# Altium schematic sheet SH4 - Level Shifter.SchDoc
size A4
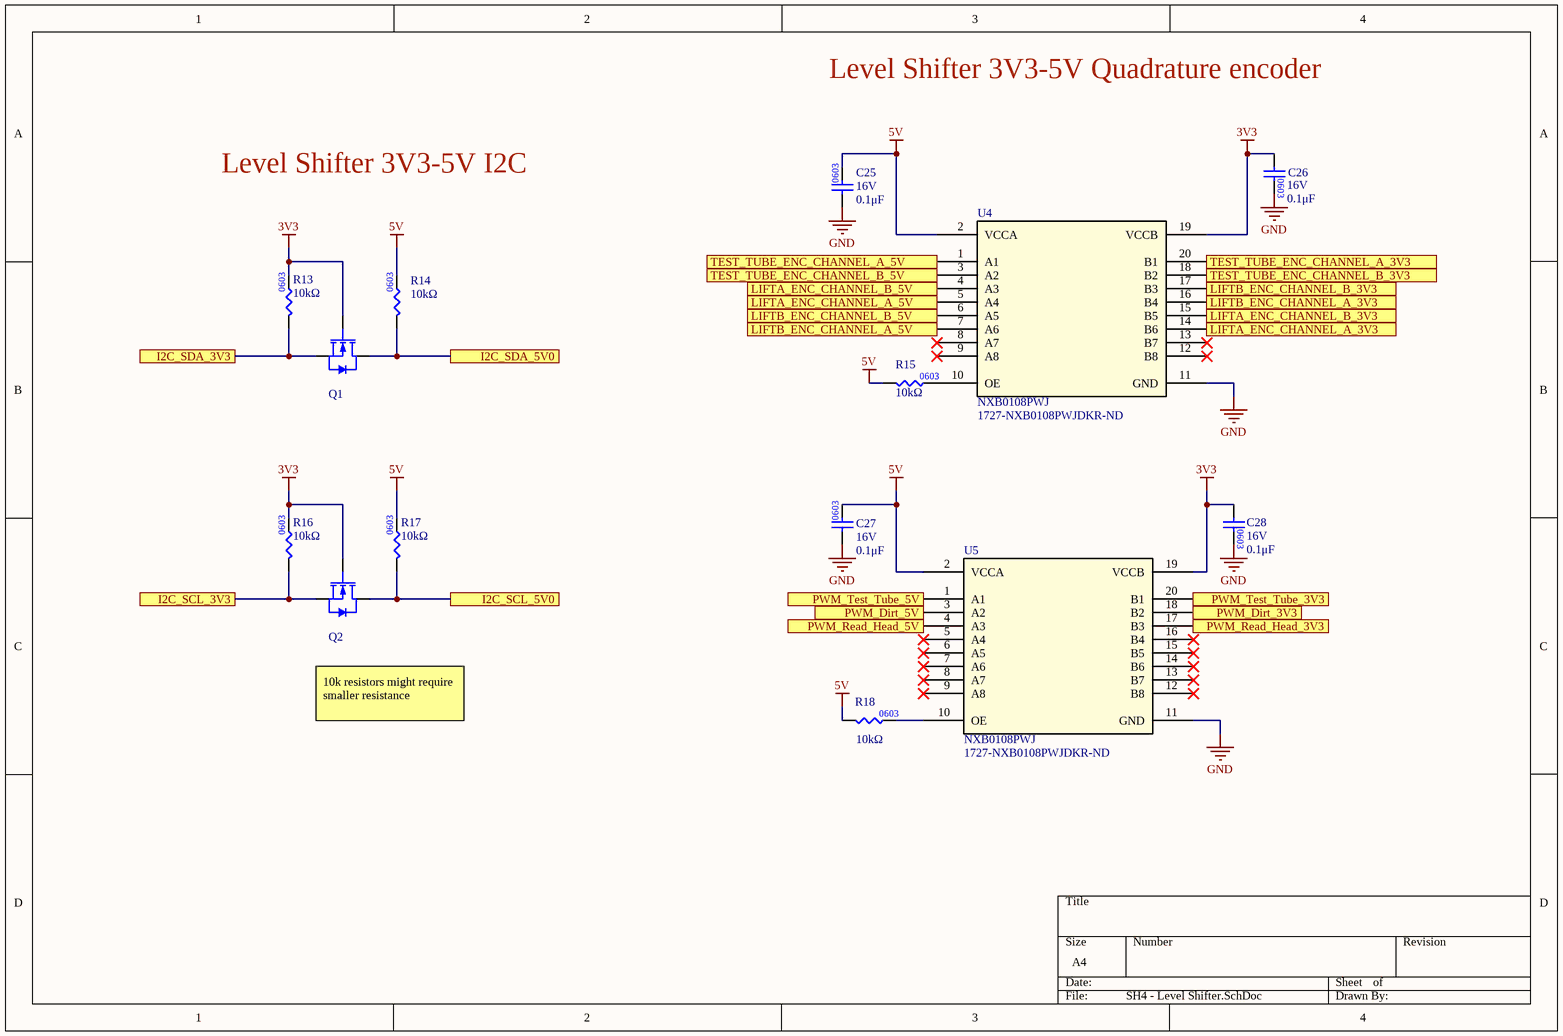
[diagram p0: SH4 - Level Shifter.SchDoc]

## Parts
C25  value 0.1μF  Voltage Rating: 16V  [CAP0603]  (hidden comment: CAP_0.1uF_16V_0603)
C26  value 0.1μF  Voltage Rating: 16V  [CAP0603]  (hidden comment: CAP_0.1uF_16V_0603)
C27  value 0.1μF  Voltage Rating: 16V  [CAP0603]  (hidden comment: CAP_0.1uF_16V_0603)
C28  value 0.1μF  Voltage Rating: 16V  [CAP0603]  (hidden comment: CAP_0.1uF_16V_0603)
Q1  NMOS_60V_280mA  [SOT-323]  (value not drawn)
Q2  NMOS_60V_280mA  [SOT-323]  (value not drawn)
R13  value 10kΩ  [RES0603]  (hidden comment: RES_10kΩ_0603_5%)
R14  value 10kΩ  [RES0603]  (hidden comment: RES_10kΩ_0603_5%)
R15  value 10kΩ  [RES0603]  (hidden comment: RES_10kΩ_0603_5%)
R16  value 10kΩ  [RES0603]  (hidden comment: RES_10kΩ_0603_5%)
R17  value 10kΩ  [RES0603]  (hidden comment: RES_10kΩ_0603_5%)
R18  value 10kΩ  [RES0603]  (hidden comment: RES_10kΩ_0603_5%)
U4  Manufacturer Part Number 1: NXB0108PWJ  Supplier Part Number 1: 1727-NXB0108PWJDKR-ND  [LEVEL_SHIFTER_8_CHANNEL]  (hidden comment: IC_LVL_SHIFTER_8_CH)
U5  Manufacturer Part Number 1: NXB0108PWJ  Supplier Part Number 1: 1727-NXB0108PWJDKR-ND  [LEVEL_SHIFTER_8_CHANNEL]  (hidden comment: IC_LVL_SHIFTER_8_CH)

## Ports
I2C_SCL_3V3, I2C_SCL_5V0, I2C_SDA_3V3, I2C_SDA_5V0, LIFTA_ENC_CHANNEL_A_3V3, LIFTA_ENC_CHANNEL_A_5V, LIFTA_ENC_CHANNEL_B_3V3, LIFTA_ENC_CHANNEL_B_5V, LIFTB_ENC_CHANNEL_A_3V3, LIFTB_ENC_CHANNEL_A_5V, LIFTB_ENC_CHANNEL_B_3V3, LIFTB_ENC_CHANNEL_B_5V, PWM_Dirt_3V3, PWM_Dirt_5V, PWM_Read_Head_3V3, PWM_Read_Head_5V, PWM_Test_Tube_3V3, PWM_Test_Tube_5V, TEST_TUBE_ENC_CHANNEL_A_3V3, TEST_TUBE_ENC_CHANNEL_A_5V, TEST_TUBE_ENC_CHANNEL_B_3V3, TEST_TUBE_ENC_CHANNEL_B_5V

## Nets
3V3: C26.1 C28.1 Q1.1(Gate) Q2.1(Gate) R13.2 R16.2 U4.19(VCCB) U5.19(VCCB)
5V: C25.2 C27.2 R14.2 R15.1 R17.2 R18.1 U4.2(VCCA) U5.2(VCCA)
GND: C25.1 C26.2 C27.1 C28.2 U4.11(GND) U5.11(GND)
I2C_SCL_3V3: Q2.2(Source) R16.1 ; port I2C_SCL_3V3
I2C_SCL_5V0: Q2.3(Drain) R17.1 ; port I2C_SCL_5V0
I2C_SDA_3V3: Q1.2(Source) R13.1 ; port I2C_SDA_3V3
I2C_SDA_5V0: Q1.3(Drain) R14.1 ; port I2C_SDA_5V0
LIFTA_ENC_CHANNEL_A_3V3: U4.14(B6) ; port LIFTA_ENC_CHANNEL_A_3V3
LIFTA_ENC_CHANNEL_A_5V: U4.5(A4) ; port LIFTA_ENC_CHANNEL_A_5V
LIFTA_ENC_CHANNEL_B_3V3: U4.15(B5) ; port LIFTA_ENC_CHANNEL_B_3V3
LIFTA_ENC_CHANNEL_B_5V: U4.4(A3) ; port LIFTA_ENC_CHANNEL_B_5V
LIFTB_ENC_CHANNEL_A_3V3: U4.16(B4) ; port LIFTB_ENC_CHANNEL_A_3V3
LIFTB_ENC_CHANNEL_A_5V: U4.7(A6) ; port LIFTB_ENC_CHANNEL_A_5V
LIFTB_ENC_CHANNEL_B_3V3: U4.17(B3) ; port LIFTB_ENC_CHANNEL_B_3V3
LIFTB_ENC_CHANNEL_B_5V: U4.6(A5) ; port LIFTB_ENC_CHANNEL_B_5V
PWM_Dirt_3V3: U5.18(B2) ; port PWM_Dirt_3V3
PWM_Dirt_5V: U5.3(A2) ; port PWM_Dirt_5V
PWM_Read_Head_3V3: U5.17(B3) ; port PWM_Read_Head_3V3
PWM_Read_Head_5V: U5.4(A3) ; port PWM_Read_Head_5V
PWM_Test_Tube_3V3: U5.20(B1) ; port PWM_Test_Tube_3V3
PWM_Test_Tube_5V: U5.1(A1) ; port PWM_Test_Tube_5V
TEST_TUBE_ENC_CHANNEL_A_3V3: U4.20(B1) ; port TEST_TUBE_ENC_CHANNEL_A_3V3
TEST_TUBE_ENC_CHANNEL_A_5V: U4.1(A1) ; port TEST_TUBE_ENC_CHANNEL_A_5V
TEST_TUBE_ENC_CHANNEL_B_3V3: U4.18(B2) ; port TEST_TUBE_ENC_CHANNEL_B_3V3
TEST_TUBE_ENC_CHANNEL_B_5V: U4.3(A2) ; port TEST_TUBE_ENC_CHANNEL_B_5V
NetR15_2: R15.2 U4.10(OE)
NetR18_2: R18.2 U5.10(OE)

Not connected (* = marked no-connect by the designer): U4 8(A7)* 9(A8)* 12(B8)* 13(B7)*; U5 5(A4)* 6(A5)* 7(A6)* 8(A7)* 9(A8)* 12(B8)* 13(B7)* 14(B6)* 15(B5)* 16(B4)*

## Notes on the sheet
- Level Shifter 3V3-5V Quadrature encoder
- Level Shifter 3V3-5V I2C
- 10k resistors might require smaller resistance

## Library data of the parts
C25-C28 = CAP_0.1uF_16V_0603: CAP CER 0.1UF 16V X7R 0603; Manufacturer Part Number 1: CC0603KRX7R7BB104; Manufacturer 1: Yageo; Package: 0603; Supplier Part Number 1: 311-1088-1-ND; Supplier 1: Digi-Key; Dielectric: X7R
Q1 Q2 = NMOS_60V_280mA: MOSFET N-CH 60V 280MA SOT323-3; Manufacturer 1: Infineon Technologies; Manufacturer Part Number 1: BSS138WH6327XTSA1; FET Type: N-Channel; Vgs (Max): 20V; Power Dissipation (Max): 500mW; Vdss: 60V; Supplier Device Package: SOT-323; Id: 280mA; Supplier 1: Digi-Key; Supplier Part Number 1: BSS138WH6327XTSA1CT-ND
R13-R18 = RES_10kΩ_0603_5%: RES 10K OHM 5% 1/10W 0603; Manufacturer 1: Yageo; Manufacturer Part Number 1: RC0603JR-0710KL; Supplier Part Number 1: 311-10KGRCT-ND; Supplier 1: Digi-Key; Mounting Type: SMD; Package: 0603
U4 U5 = IC_LVL_SHIFTER_8_CH_NEXPERIA: IC BIDIRECTIONAL LEVEL SHIFTER 8 CHANNEL 20TSSOP NEXPERIA; Manufacturer 1: Nexperia USA Inc.; Package/Footprint: 20-TSSOP; Mounting Type: SMD; Supplier 1: Digi-Key